# EAGLE board clouds_v30 (EAGLE 7.5.0)
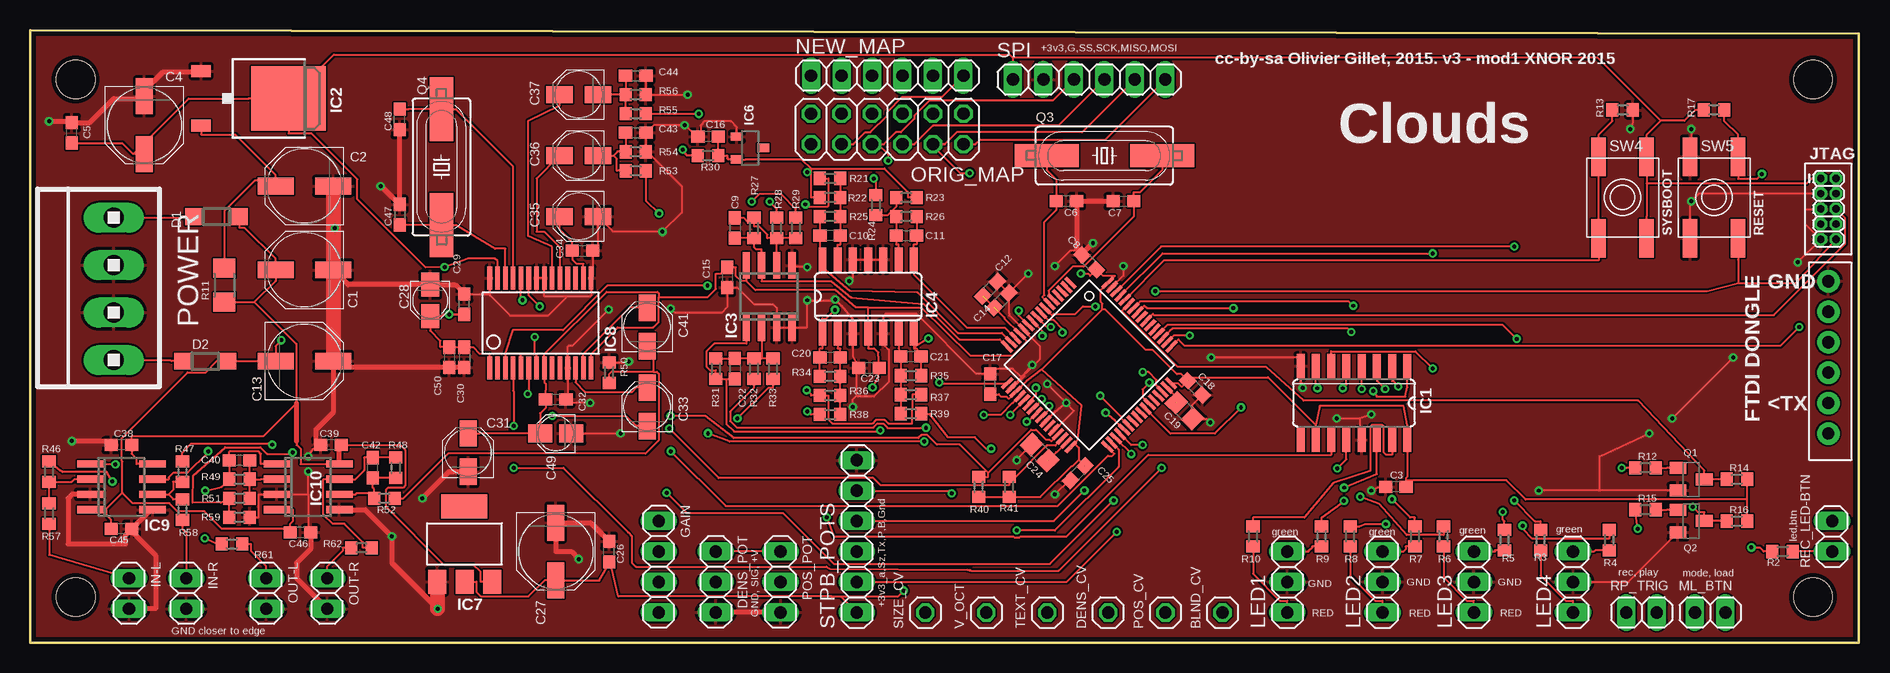
[diagram p4: board, top side]
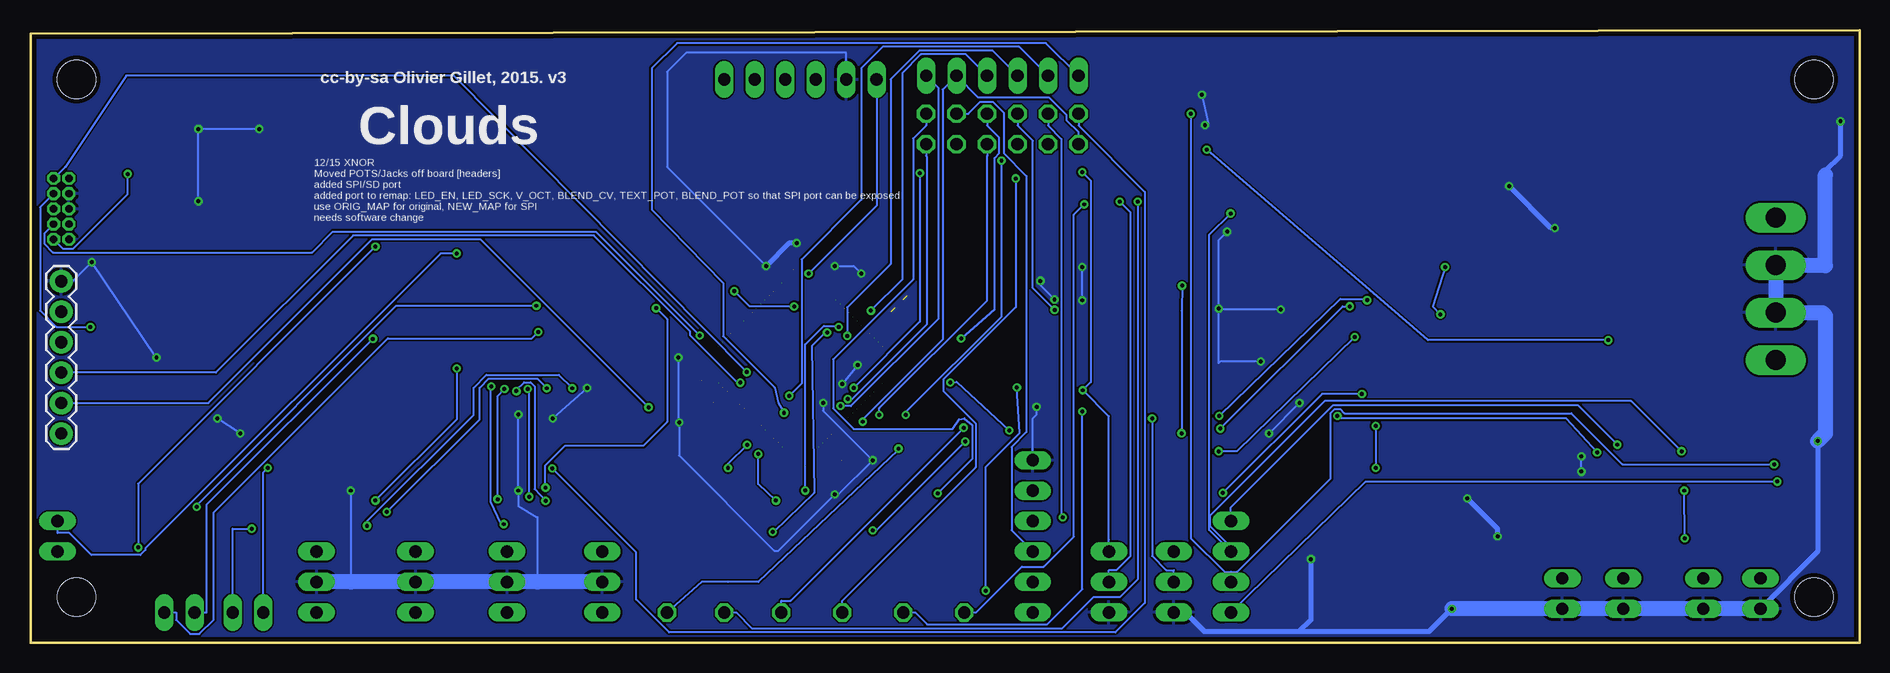
[diagram p5: board, bottom side, seen from below]

Size 152.4 x 51.12 mm. Coordinates in mm from the lower left corner, seen from the top.
Outline: 0,0 152.4,0 152.4,50.8 0,51.12 0,0
Copper layers (1*16): Top 0.0356mm / dielectric 1.5011mm / Bottom 0.0356mm
Design rules "LaenPCBOrder": minimum track width 6mil, minimum drill 13mil, track to track 6mil, track to pad 6mil, pad to pad 6mil, via to via 6mil, smd to smd 6mil, copper to edge 15mil, drill to drill 6mil, minimum pad ring 7mil, minimum via ring 7mil, stop-mask expansion 3mil, vias tented up to drill 0mil, thermal gap 10mil
Holes 3.2 mm at 3.81,46.99 3.81,3.81 148.59,46.99 148.59,3.81

## Footprints (pad centres in the part's own frame; a part is rotated, then mirrored left to right if it is on the bottom)
1X01 = drill 1.016 octagon: 1 0,0
PANASONIC_D = smd 3 x 1.4: + 2.4,0; - -2.4,0
C0603 = smd 1.1 x 1: 1 -0.85,0; 2 0.85,0
C0805 = smd 1.3 x 1.5: 1 -0.95,0; 2 0.95,0
PANASONIC_A = smd 2 x 1.5: + 1.3,0; - -1.3,0
PANASONIC_B = smd 2.2 x 1.4: + 1.6,0; - -1.6,0
SOD123 = smd 1.4 x 1.4: A 1.9,0; C -1.9,0
1X03 = drill 1.016 long: 1 -2.54,0; 2 0,0; 3 2.54,0
1X04 = drill 1.016 long: 1 -3.81,0; 2 -1.27,0; 3 1.27,0; 4 3.81,0
SO16 = smd 0.66 x 2.032: 1 -4.445,-3.073; 2 -3.175,-3.073; 3 -1.905,-3.073; 4 -0.635,-3.073; 5 0.635,-3.073; 6 1.905,-3.073; 7 3.175,-3.073; 8 4.445,-3.073; 9 4.445,3.073; 10 3.175,3.073; 11 1.905,3.073; 12 0.635,3.073; 13 -0.635,3.073; 14 -1.905,3.073; 15 -3.175,3.073; 16 -4.445,3.073
TO252 = smd 1 x 1.6: 1 -2.28,-4.8; 2 2.28,-4.8 | smd 5.4 x 6.2: 3 0,2.5
SO08 = smd 0.6 x 2.2: 1 -1.905,-2.6; 2 -0.635,-2.6; 3 0.635,-2.6; 4 1.905,-2.6; 5 1.905,2.6; 6 0.635,2.6; 7 -0.635,2.6; 8 -1.905,2.6
SO14 = smd 0.66 x 2.032: 1 -3.81,-3.073; 2 -2.54,-3.073; 3 -1.27,-3.073; 4 0,-3.073; 5 1.27,-3.073; 6 2.54,-3.073; 7 3.81,-3.073; 8 3.81,3.073; 9 2.54,3.073; 10 1.27,3.073; 11 0,3.073; 12 -1.27,3.073; 13 -2.54,3.073; 14 -3.81,3.073
TQFP-10X10-64 = smd 1.2 x 0.3: 1 -5.936,3.75; 2 -5.936,3.25; 3 -5.936,2.75; 4 -5.936,2.25; 5 -5.936,1.75; 6 -5.936,1.25; 7 -5.936,0.75; 8 -5.936,0.25; 9 -5.936,-0.25; 10 -5.936,-0.75; 11 -5.936,-1.25; 12 -5.936,-1.75; 13 -5.936,-2.25; 14 -5.936,-2.75; 15 -5.936,-3.25; 16 -5.936,-3.75; 33 5.886,-3.75; 34 5.886,-3.25; 35 5.886,-2.75; 36 5.886,-2.25; 37 5.886,-1.75; 38 5.886,-1.25; 39 5.886,-0.75; 40 5.886,-0.25; 41 5.886,0.25; 42 5.886,0.75; 43 5.886,1.25; 44 5.886,1.75; 45 5.886,2.25; 46 5.886,2.75; 47 5.886,3.25; 48 5.886,3.75 | smd 0.3 x 1.2: 17 -3.75,-5.911; 18 -3.25,-5.911; 19 -2.75,-5.911; 20 -2.25,-5.911; 21 -1.75,-5.911; 22 -1.25,-5.911; 23 -0.75,-5.911; 24 -0.25,-5.911; 25 0.25,-5.911; 26 0.75,-5.911; 27 1.25,-5.911; 28 1.75,-5.911; 29 2.25,-5.911; 30 2.75,-5.911; 31 3.25,-5.911; 32 3.75,-5.911; 49 3.75,5.936; 50 3.25,5.936; 51 2.75,5.936; 52 2.25,5.936; 53 1.75,5.936; 54 1.25,5.936; 55 0.75,5.936; 56 0.25,5.936; 57 -0.25,5.936; 58 -0.75,5.936; 59 -1.25,5.936; 60 -1.75,5.936; 61 -2.25,5.936; 62 -2.75,5.936; 63 -3.25,5.936; 64 -3.75,5.936
DBZ_R-PDSO-G3 = smd 0.7 x 1: 1 -0.95,-1.1; 2 0.95,-1.1; 3 0,1.1
SOT223 = smd 1.499 x 2.007: 1 -2.261,-3.15; 2 0.025,-3.15; 3 2.311,-3.15 | smd 3.81 x 2.007: 4 0,3.15
SSOP28 = smd 0.381 x 1.905: 1 -4.55,-3.752; 2 -3.9,-3.752; 3 -3.25,-3.752; 4 -2.6,-3.752; 5 -1.95,-3.752; 6 -1.3,-3.752; 7 -0.65,-3.752; 8 0,-3.752; 9 0.65,-3.752; 10 1.3,-3.752; 11 1.95,-3.752; 12 2.6,-3.752; 13 3.25,-3.752; 14 3.9,-3.752; 15 3.9,3.752; 16 3.25,3.752; 17 2.6,3.752; 18 1.95,3.752; 19 1.3,3.752; 20 0.65,3.752; 21 0,3.752; 22 -0.65,3.752; 23 -1.3,3.752; 24 -1.95,3.752; 25 -2.6,3.752; 26 -3.25,3.752; 27 -3.9,3.752; 28 -4.55,3.752
1X02 = drill 1.016 long: 1 -1.27,0; 2 1.27,0
1X06 = drill 1.016 pad 1.88: 1 0,0; 2 2.54,0; 3 5.08,0; 4 7.62,0; 5 10.16,0; 6 12.7,0
2X5-1.27 = drill 0.61 pad 1.067 octagon: 1 -1.27,3.81; 2 0,3.81; 3 -1.27,2.54; 4 0,2.54; 5 -1.27,1.27; 6 0,1.27; 7 -1.27,0; 8 0,0; 9 -1.27,-1.27; 10 0,-1.27
1X06' = drill 1.016 long: 1 -6.35,0; 2 -3.81,0; 3 -1.27,0; 4 1.27,0; 5 3.81,0; 6 6.35,0
2X06 = drill 1.016 octagon: 1 -6.35,-1.27; 2 -6.35,1.27; 3 -3.81,-1.27; 4 -3.81,1.27; 5 -1.27,-1.27; 6 -1.27,1.27; 7 1.27,-1.27; 8 1.27,1.27; 9 3.81,-1.27; 10 3.81,1.27; 11 6.35,-1.27; 12 6.35,1.27
1X4MTA = drill 1.676 long: 1 5.944,0; 2 1.981,0; 3 -1.981,0; 4 -5.944,0
SOT23-BEC = smd 1 x 1.4: B -0.95,-1.1; C 0,1.1; E 0.95,-1.1
HC49UP = smd 5.334 x 1.93: 1 -4.826,0; 2 4.826,0
R0603 = smd 1 x 1.1: 1 -0.85,0; 2 0.85,0
R1206 = smd 1.6 x 1.803: 1 -1.422,0; 2 1.422,0
EVQ-Q2 = smd 3.2 x 1.2: A -3.4,-2; A' 3.4,-2; B -3.4,2; B' 3.4,2

## Placement (x,y rotation side)
BLND_CV  [1X01]  99.38,2.54 90 top
C1  47u  [PANASONIC_D]  22.86,31.11 180 top
C2  47u  [PANASONIC_D]  22.86,38.1 180 top
C3  100n  [C0603]  113.82,13.02 180 top
C4  47u  [PANASONIC_D]  9.53,43.18 270 top
C5  100n  [C0603]  3.49,42.55 90 top
C6  18p  [C0603]  86.36,36.83 180 top
C7  18p  [C0603]  91.12,36.83 0 top
C8  100n  [C0603]  88.27,31.75 135 top
C9  1n  [C0603]  58.74,34.61 270 top
C10  1n  [C0603]  66.67,33.97 180 top
C11  1n  [C0603]  73.03,33.97 0 top
C12  1u  [C0603]  80.01,29.53 45 top
C13  47u  [PANASONIC_D]  22.86,23.5 0 top
C14  100n  [C0603]  80.96,28.57 45 top
C15  100n  [C0603]  58.1,30.48 270 top
C16  100n  [C0603]  56.52,42.23 180 top
C17  100n  [C0603]  80.01,21.59 90 top
C18  100n  [C0603]  97.09,21.27 315 top
C19  2.2u  [C0805]  96.2,19.37 315 top
C20  1n  [C0603]  66.67,23.81 180 top
C21  1n  [C0603]  73.41,23.88 0 top
C22  1n  [C0603]  58.74,22.86 270 top
C23  100n  [C0603]  69.91,22.92 180 top
C24  2.2u  [C0805]  84.14,15.88 135 top
C25  100n  [C0603]  87.31,14.16 225 top
C26  100n  [C0603]  48.26,7.62 90 top
C27  47u  [PANASONIC_D]  43.81,7.62 270 top
C28  10u  [PANASONIC_A]  33.34,28.57 270 top
C29  100n  [C0603]  36.2,28.26 90 top
C30  100n  [C0603]  36.2,23.81 270 top
C31  10u  [PANASONIC_B]  36.51,15.88 90 top
C32  100n  [C0603]  43.81,20.32 0 top
C33  10u  [PANASONIC_B]  51.44,19.68 90 top
C34  100n  [C0603]  46.04,32.7 0 top
C35  10u  [PANASONIC_B]  45.72,35.56 180 top
C36  10u  [PANASONIC_B]  45.72,40.64 180 top
C37  10u  [PANASONIC_B]  45.72,45.72 180 top
C38  100n  [C0603]  7.62,16.51 180 top
C39  100n  [C0603]  25.08,16.51 180 top
C40  18p  [C0603]  17.46,15.24 180 top
C41  10u  [PANASONIC_B]  51.44,26.35 90 top
C42  18p  [C0603]  28.57,14.61 90 top
C43  220p  [C0603]  50.48,42.55 0 top
C44  220p  [C0603]  50.48,47.31 0 top
C45  100n  [C0603]  7.62,9.53 180 top
C46  100n  [C0603]  22.54,9.21 180 top
C47  18p  [C0603]  30.8,35.72 270 top
C48  18p  [C0603]  30.8,43.66 90 top
C49  10u  [PANASONIC_A]  43.81,17.46 180 top
C50  1u  [C0603]  34.92,23.81 270 top
D1  1N5819HW  [SOD123]  15.56,35.56 180 top
D2  1N5819HW  [SOD123]  14.61,23.5 0 top
DENS_CV  [1X01]  89.85,2.54 90 top
DENS_POT  [1X03]  57.15,5.08 270 top
GAIN  [1X04]  52.39,6.35 270 top
IC1  74HC595D  [SO16]  110.33,20 180 top
IC2  LM1117-3.3  [TO252]  19.05,45.4 270 top
IC3  MCP6002  [SO08]  61.59,28.89 0 top
IC4  MCP6004  [SO14]  69.85,28.89 0 top
IC5  STM32F405RGT6  [TQFP-10X10-64]  88.27,23.18 315 top
IC6  LM4040B10  [DBZ_R-PDSO-G3]  60.01,41.27 270 top
IC7  LM1117-3.3  [SOT223]  36.2,8.26 0 top
IC8  WM8731  [SSOP28]  42.86,26.67 0 top
IC9  TL072D  [SO08]  7.62,13.02 270 top
IC10  TL072D  [SO08]  23.18,13.02 270 top
IN-L  [1X02]  8.26,4.13 270 top
IN-R  [1X02]  13.02,4.13 270 top
JP1  [1X06]  149.86,30.16 270 bottom
JP2  M05X2MINIJTAG  [2X5-1.27]  150.5,34.92 0 top
LED1  [1X03]  104.78,5.08 90 top
LED2  [1X03]  112.71,5.08 90 top
LED3  [1X03]  120.33,5.08 90 top
LED4  [1X03]  128.59,5.08 90 top
ML_BTN  [1X02]  140.02,2.54 0 top
NEW_MAP  [1X06']  71.44,47.31 0 top
ORIG_MAP  [2X06]  71.44,42.86 0 top
OUT-L  [1X02]  19.68,4.13 270 top
OUT-R  [1X02]  24.77,4.13 270 top
POS_CV  [1X01]  94.61,2.54 90 top
POS_POT  [1X03]  62.55,5.08 270 top
POWER  [1X4MTA]  6.99,29.53 90 top
Q1  MMBT3904  [SOT23-BEC]  138.43,13.65 270 top
Q2  MMBT3904  [SOT23-BEC]  138.43,10.16 270 top
Q3  8MHz  [HC49UP]  89.53,40.64 0 top
Q4  12.288MHz  [HC49UP]  34.29,39.69 90 top
R2  RLED  [R0603]  146.05,7.62 0 top
R3  RLED  [R0603]  125.89,8.57 90 top
R4  RLED  [R0603]  131.6,8.57 90 top
R5  RLED  [R0603]  122.87,8.57 90 top
R6  RLED  [R0603]  117.79,8.89 90 top
R7  RLED  [R0603]  115.41,8.89 90 top
R8  RLED  [R0603]  110.01,8.89 90 top
R9  RLED  [R0603]  107.63,8.89 90 top
R10  RLED  [R0603]  101.92,8.89 90 top
R11  4.7  [R1206]  16.19,29.84 90 top
R12  100k  [R0603]  134.62,14.61 0 top
R13  10k  [R0603]  132.72,44.45 180 top
R14  10k  [R0603]  142.24,13.65 0 top
R15  100k  [R0603]  134.62,11.11 0 top
R16  10k  [R0603]  142.24,10.16 0 top
R17  10k  [R0603]  140.34,44.45 180 top
R21  100k  [R0603]  66.67,38.73 180 top
R22  200k  [R0603]  66.67,37.15 180 top
R23  200k  [R0603]  73.03,37.15 0 top
R24  100k  [R0603]  70.48,36.51 90 top
R25  33k  [R0603]  66.67,35.56 0 top
R26  33k  [R0603]  73.03,35.56 180 top
R27  66.5k  [R0603]  60.33,34.61 90 top
R28  200k  [R0603]  62.23,34.61 90 top
R29  100k  [R0603]  63.82,34.61 90 top
R30  470  [R0603]  56.52,40.64 0 top
R31  66.5k  [R0603]  57.15,22.86 90 top
R32  100k  [R0603]  60.33,22.86 270 top
R33  200k  [R0603]  61.91,22.86 270 top
R34  47k  [R0603]  66.67,22.23 0 top
R35  33k  [R0603]  73.41,22.29 180 top
R36  180k  [R0603]  66.67,20.64 180 top
R37  200k  [R0603]  73.41,20.7 0 top
R38  100k  [R0603]  66.67,19.05 180 top
R39  100k  [R0603]  73.41,19.11 0 top
R40  2.2k  [R0603]  79.06,13.02 270 top
R41  2.2k  [R0603]  81.6,13.02 270 top
R46  3.3k  [R0603]  1.59,14.29 270 top
R47  3.3k  [R0603]  12.7,14.29 270 top
R48  39k  [R0603]  30.48,14.61 270 top
R49  39k  [R0603]  17.46,13.65 0 top
R50  39k  [R0603]  48.26,22.54 270 top
R51  5.6k  [R0603]  17.46,12.06 180 top
R52  5.6k  [R0603]  29.53,12.06 0 top
R53  5.6k  [R0603]  50.48,39.37 0 top
R54  5.6k  [R0603]  50.48,40.96 180 top
R55  5.6k  [R0603]  50.48,44.13 0 top
R56  5.6k  [R0603]  50.48,45.72 180 top
R57  22k  [R0603]  1.59,10.79 270 top
R58  22k  [R0603]  12.7,11.11 270 top
R59  39k  [R0603]  17.46,10.48 180 top
R61  1.0k  [R0603]  16.83,8.26 180 top
R62  1.0k  [R0603]  27.62,7.94 0 top
REC_LED-BTN  [1X02]  150.18,8.89 90 top
RP_TRIG  [1X02]  134.3,2.54 0 top
SIZE_CV  [1X01]  74.61,2.54 90 top
SPI  [1X06']  88.27,46.99 0 top
STPB_POTS  [1X06']  68.9,8.89 90 top
SW4  [EVQ-Q2]  132.72,37.15 270 top
SW5  [EVQ-Q2]  140.34,37.15 270 top
TEXT_CV  [1X01]  84.77,2.54 90 top
V_OCT  [1X01]  79.69,2.54 90 top

## Tracks (layer width: path | path; a pad name or v marks a point on that pad's centre or on a via)
+3V3  (via drill 0.33 pad 0.3, 0.33 pad 0.69)  (7 unrouted)
  Top 0.152: 95.94,22.42 | 95.94,22.42 95.57,22.42 93.55,24.45 92.98,24.45 89.6,27.82 89.36,27.82 | 84.33,22.8 89.36,27.82 | 84.33,22.8 87.64,19.81 87.32,16.93 87.03,16.64 | 84.33,22.8 83.05,21.85 82.73,21.53 IC5.19 81.85,20.65 81.56,20.36 81.38,20.53 80.95,20.53 80.74,20.74 C17.1 | 87.03,16.64 87.4,16.27 87.4,15.28 | 87.4,15.28 | IC5.32 87.03,16.64 | C25.1 87.4,15.28 | 87.4,15.28 86.88,14.76 86.8,14.76 84.2,12.17 R41.2 R40.2 | 96.22,22.15 103.18,22.15 107.16,18.17 | 143.09,11.96 R14.2 | R16.2 143.09,11.96 | 143.09,11.96 124.63,11.96 123.03,13.56 114.67,13.56 | 114.67,13.56 114.67,13.75 114.78,13.85 IC1.16 114.78,18.17 114.47,19.75 107.46,19.75 107.16,18.17 | C3.1 114.67,13.56 | 96.22,22.15 95.94,22.42 | 96.22,22.15 C18.1 96.3,21.68 95.97,21.36 95.67,21.67 IC5.48 | 135.89,43.55 130.66,48.79 81.92,48.79 | 135.89,43.55 137.86,43.55 138.76,44.45 139.12,44.45 R17.2 | 135.89,43.55 | 135.89,43.55 134.72,42.38 134.72,41.46 SW4.B 134.72,38.34 | 81.92,48.79 SPI.1 | 21.55,45.28 25.33,49.07 81.64,49.07 81.92,48.79 | 21.55,45.28 IC2.3 18.22,45.4 13.22,45.4 8.6,40.78 | 21.55,45.28 21.55,45.27 21.55,42.47 23.48,42.47 27.29,38.66 27.29,37 32.97,31.32 34.57,31.35 34.58,31.34 | 89.36,27.82 89.36,28.3 89.22,28.43 89.22,29.44 | 89.22,29.44 | v87.58,30.8 88.19,30.8 88.35,30.63 C8.1 89.42,30.6 89.43,30.61 90.4,30.61 | 134.72,38.34 134.72,35.58 SW4.B' | 134.72,38.34 148.07,38.34 148.46,38.73 JP2.1 | C5.1 7.68,41.7 8.6,40.78 | C4.+ 8.6,40.78 | 89.22,29.44 IC5.64 90.1,30.32 90.4,30.61 | C29.1 v34.92,27.41 | v34.92,27.41 34.45,27.41 34.32,27.27 C28.+ 33.34,26.05 34.2,25.19 34.2,24.66 C50.1 C30.1 36.92,24.66 37.49,24.1 38.31,24.1 IC8.1
  Top 0.152: 36.56,27.41 C29.1 | IC1.10 107.16,18.17 | 90.4,30.61 | IC8.27 38.96,31.84 38.73,32.07 36.51,32.07 34.58,31.34 | 34.58,31.34 v34.54,31.34 | v34.92,27.41 C29.1
  Bottom 0.152: SPI.1 81.92,36.46 v87.58,30.8 | v34.54,31.34 35.56,28.04 v34.92,27.41
+3V3_A  (via drill 0.33 pad 0.69)  (3 unrouted)
  Top 0.152: 52.39,28.81 52.39,29.16 52.27,29.28 48.05,29.28 42.86,24.1 IC8.8 42.86,21.74 42.97,21.63 42.97,21.05 C32.1 42.97,19.59 42.52,19.14 42.52,18.44 C49.+ 37.45,17.46 37.44,17.48 C31.+ | 52.39,28.81 52.39,26.78 51.92,26.31 48.97,26.31 46.76,24.1 46.76,23.43 IC8.14 | 52.39,28.81 56.44,28.81 56.44,28.82 57.15,29.53 57.15,30.8 57.57,30.8 C15.1 58.83,31.33 58.83,30.6 59.27,30.16 59.69,30.16 | 69.85,27.95 68.83,27.98 67.09,29.44 60.44,29.41 59.69,30.16 | 66.81,3.88 49.02,3.88 48.35,6.77 | 66.81,3.88 72.34,3.88 v72.81,4.36 | v70.22,21.31 70.7,22.18 C23.1 70.7,24.22 70.35,24.57 69.85,24.57 69.85,25.2 IC4.4 69.85,26.99 69.85,27.95 | 69.85,27.95 74.27,27.95 78.35,23.96 81.88,23.96 83.06,25.15 83.06,25.2 IC5.13 81.19,27.07 81.19,27.14 | 81.19,27.14 | 79.73,28.61 80.68,27.66 80.94,27.4 81.19,27.14 | IC3.8 59.69,30.24 59.69,30.16 | 59.69,30.16 | 48.35,6.77 48.62,6.77 48.35,6.77 | 48.35,6.77 C26.1 | 48.35,6.77 47.44,5.22 C27.+ 43.35,5.22 42.89,5.22 41.54,3.87 37.58,3.87 37.2,4.25 37.2,5.11 IC7.2 | 66.81,3.88 67.56,3.88 STPB_POTS.1
  Bottom 0.152: v72.81,4.36 72.81,14.69 69.99,17.51 v70.22,21.31
AREF_-10  (via drill 0.33 pad 0.69)
  Top 0.152: R37.2 73.53,20.7 73.5,18.28 72.78,18.27 71.54,18.27 71.22,18.59 70.5,18.59 70.17,18.27 66.88,18.27 66.55,18.6 66.55,20.64 R36.2 65.1,20.64 65.1,20.71 v64.73,21.08 | 65.1,39.27 65.1,39.56 | 65.1,39.27 65.1,37.15 R22.2 | v64.77,39.27 65.1,39.27 | 65.1,39.56 64.33,40.33 59.64,40.33 IC6.2 58.18,40.33 58.09,40.41 58.09,40.64 57.73,40.64 | 65.1,39.56 71.19,39.56 73.15,37.6 73.15,37.15 R23.2 | 57.73,40.64 57.37,41 C16.1 | R30.2 57.73,40.64 | POS_POT.1 DENS_POT.1
  Bottom 0.152: v64.77,39.27 64.05,38.55 64.05,21.76 v64.73,21.08 62.55,18.89 62.55,8.61 POS_POT.1
BLEND_CV  (via drill 0.33 pad 0.69)
  Top 0.152: 73.66,24.63 73.66,24.57 73.84,24.57 73.88,24.54 C21.2 R35.1 | IC4.7 73.66,24.63 | v74.87,25.39 73.66,24.63
  Bottom 0.152: v74.87,25.39 72.08,27.84 72.08,40.45 71.7,40.83 71.7,42.13 72.71,43.14 ORIG_MAP.8
BLEND_POT  (via drill 0.33 pad 0.69)
  Top 0.152: STPB_POTS.5 76.6,12.7 v76.82,12.48
  Bottom 0.152: v76.82,12.48 73.96,15.34 73.96,18.18 74.59,18.74 75.03,18.65 75.58,17.84 83.82,17.84 85.53,19.56 85.53,23.64 78.87,30.3 78.87,42.06 77.79,43.14 ORIG_MAP.12
BOOT_FLASH  (1 unrouted)
  Top 0.152: IC5.60 94.53,31.91 130.71,31.91 130.72,31.92 SW4.A' SW4.A 130.72,42.38 131.87,43.53 R13.2
DENSITY_CV  (via drill 0.33 pad 0.69)  (1 unrouted)
  Top 0.152: 58.03,22.01 58.03,18.27 58.68,17.63 70.77,17.63 v70.86,17.72 | 58.03,22.01 C22.2 | 58.03,22.01 R31.1 57.15,22.74 56.7,22.74 56.37,23.06 56.37,24.31 57.02,24.96 59.69,24.96 IC3.1 | v75.78,21.72 75.85,21.65 IC5.17
  Bottom 0.152: v75.78,21.72 75.24,21.78 v70.86,17.72
GND  (via drill 0.33, 0.33 pad 0.3, 0.33 pad 0.69)
  Top 0.152: v98.42,23.81 105.73,23.81 IC1.8 105.89,21.75 v106.05,21.27 | LED4.2 133.2,5.08 Q2.E | R13.1 133.56,43.4 v133.35,42.86 | v138.43,42.86 138.43,40.64 SW5.A | SW5.A' 138.34,36.73 v138.43,36.83 139.06,37.47 JP2.3 JP2.5 147.96,36.2 147.96,34.92 JP2.9 v147.32,31.75 | v125.73,12.7 Q1.E 130.81,12.7 130.81,15.56 v134.94,17.46 | v136.84,18.73 v141.92,23.81 | C3.2 112.97,13.28 v111.76,12.7 | v108.9,18.73 110.81,18.73 | 110.81,18.73 110.81,17.09 IC1.13 | v111.76,19.05 110.81,18.73 | v91.12,31.43 91.12,30.63 IC5.63 | C12.2 C14.2 | C14.2 81.56,27.59 81.6,27.3 81.66,27.3 IC5.12 82.83,26.07 84.14,24.77 84.14,23.65 IC5.18 81.94,21.3 | 81.94,21.3 82.87,22.23 82.55,22.23 81.92,22.86 80.43,22.86 C17.2 78.87,22.44 73.88,27.43 71.31,27.43 71.09,27.21 71.09,25.85 IC4.5 71.12,24.89 71.56,24.45 71.56,21.78 70.33,20.54 68.99,20.54 68.9,20.64 | 87.21,32.8 87.1,32.8 87,32.7 86.68,32.7 v85.41,31.43 | v83.19,30.8 C14.2 | IC6.1 58.91,43.01 58.42,43.5 56.2,43.5 55.88,43.18 55.88,42.44 C16.2 55.56,42.23 54.61,43.18 v54.55,43.18 | v54.55,43.18 54.07,43.18 | 54.07,43.18 51.97,43.18 C43.2 R54.1 51.44,40.96 54.29,38.1 54.29,35.88 v52.7,34.29 48.59,34.29 C35.- 47.32,33.13 C34.2 46.89,30.55 IC8.15 46.76,28.98 46.67,28.89 44.77,28.89 | C44.2 R56.1 v54.8,45.72 | IC4.10 IC4.11 IC4.12 68.58,30.51 v68.26,30.19 | R59.1 19.05,10.48 19.05,12.38 IC10.3 23.18,12.38 | 23.18,12.38 23.18,9.42 C46.1 | 23.18,12.38 v23.18,14.29 | v23.18,15.56 23.6,16.19 C39.2 | v86.36,20 85.2,19.05 IC5.26 | IC5.28 85.39,17.76 87,19.37 v86.36,20 | C25.2 86.58,13.56 v85.41,12.38 | v82.23,15.24 82.23,15.31 C24.2 | 81.94,21.3 v83.5,23.18 | v84.77,21.59 v86.36,20
  Top 0.152: IC8.22 IC8.21 42.86,28.89 44.77,28.89 | C49.- v49.21,17.46 | v46.67,20 44.98,20 C32.2 44.81,20.47 IC8.11 44.81,24.71 44.9,24.8 45.21,24.8 v48.23,27.81 | v68.58,19.68 68.58,20.32 68.9,20.64 | 68.9,20.64 68.9,23.39 C23.2 68.58,23.91 IC4.3 68.58,26.99 67.6,28.13 v67.09,28.64 | v53.4,27.88 53.75,27.53 57.63,27.53 58.1,28 C15.2 58.95,29.63 60.33,28.26 61.91,28.26 62.23,27.94 IC3.3 IC3.4 64.71,26.29 64.77,26.35 v64.77,28.57 66.9,28.57 | R50.1 49.84,23.39 v49.91,23.46 | IC8.28 38.31,29 | 38.31,29 40.01,27.3 43.18,27.3 44.77,28.89 | C29.2 38.2,29.11 38.31,29 | 66.9,28.57 v67.09,28.64 | v98.36,18.38 98.05,18.7 C19.2 96.87,19.85 C18.2 | v64.77,31.34 63.66,31.34 IC3.5 | v67.09,28.64 66.9,28.57 | v54.55,43.18 54.07,43.18
  Top 0.406: C2.- 25.26,34.75 v25.4,34.61 | v29.21,38.1 29.27,38.1 C47.1 C48.1 | C1.- 26.5,29.88 C28.- 35.43,29.88 C29.2 | v1.59,43.5 3.39,43.5 C5.2 4.98,43.4 6.99,45.4 9.35,45.4 C4.- 9.53,46.04 11.11,47.62 14.19,47.62 IC2.1 | v3.49,16.83 6.45,16.83 C38.2 | IC9.5 10.06,11.11 C45.1 | IC9.3 3.49,12.38 3.17,12.06 3.17,8.26 7.94,8.26 7.94,8.99 C45.1 | C45.1 8.47,9.31 10.48,7.3 10.48,2.86 IN-L.2 | C46.1 23.39,7.83 22.23,6.67 22.23,5.4 OUT-R.2 | IC10.5 27.94,11.11 v30.16,8.89 30.16,6.67 v33.97,2.86 | C26.2 46.71,10.02 C27.- 43.81,7.62 45.09,7.62 v45.72,6.99 | POS_POT.3 DENS_POT.3 | C7.1 C6.1 87.21,32.8 C8.2 87.66,32.42 v88.58,33.34 | C39.2 23.81,16.61 23.81,17.78 25.26,19.23 C13.+ 25.79,22.96 C30.2 C50.2 | v32.7,12.06 34.92,14.29 C31.-
  Top 1.27: C2.- C1.- C13.+ | v33.97,2.86 33.97,5.07 IC7.1
  Bottom 0.152: v133.35,42.86 v138.43,42.86 v138.43,36.83 | JP1.1 148.91,30.16 v147.32,31.75 v141.92,23.81 | v125.73,12.7 125.73,5.08 | v134.94,17.46 v136.84,18.73 | 110.17,5.08 110.17,10.48 111.76,11.43 v111.76,12.7 v111.76,19.05 | v106.05,21.27 v108.9,18.73 | SPI.2 84.45,49.21 97.79,49.21 99.38,47.62 99.38,39.69 v91.12,31.43 | v85.41,31.43 83.82,31.43 v83.19,30.8 | v23.18,14.29 v23.18,15.56 | v83.5,23.18 v84.77,21.59 | v49.21,17.46 v46.67,20 | v86.36,20 86.36,19.37 v82.23,15.24 85.09,12.38 v85.41,12.38 90.11,7.68 90.42,7.68 98.36,15.62 v98.36,18.38 98.42,18.45 v98.42,23.81 | STPB_POTS.6 68.9,18.73 68.58,19.05 v68.58,19.68 | v53.4,27.88 53.4,33.59 v52.7,34.29 | v49.91,23.46 53.28,23.46 53.4,23.34 v53.4,27.88 | v48.23,27.81 53.34,27.81 v53.4,27.88 | v64.77,28.57 v64.77,31.34 | v68.26,30.19 68.26,29.84 v67.09,28.64 | v54.8,45.72 54.26,43.31 v54.55,43.18
  Bottom 0.406: v25.4,34.61 25.72,34.61 v29.21,38.1 | 2.86,39.05 2.86,39.37 1.59,40.64 v1.59,43.5 | DENS_POT.3 56.2,2.54 54.61,0.95 46.67,0.95 | 46.67,0.95 35.88,0.95 v33.97,2.86 | v45.72,6.99 45.72,1.91 46.67,0.95 | v88.58,33.34 89.22,33.34 v91.12,31.43 | v30.16,8.89 30.16,9.53 v32.7,12.06 | v3.49,16.83 3.49,7.62 IN-L.2
  Bottom 1.27: LED1.2 110.17,5.08 LED2.2 LED3.2 125.73,5.08 LED4.2 | 2.86,39.05 2.86,31.43 2.93,31.51 POWER.2 POWER.3 3.1,27.55 2.86,27.3 2.86,17.46 v3.49,16.83 | IN-L.2 IN-R.2 OUT-L.2 OUT-R.2 v33.97,2.86
  pour Bottom: 0,51.44 0,0 152.08,0.32 152.4,50.8
  pour Top: 0,51.12 152.4,50.8 153.03,0.32 0,0
I2C_SCL  (via drill 0.33 pad 0.69)  (1 unrouted)
  Top 0.152: 79.84,14.19 77.47,16.55 75.58,16.55 74.77,17.36 74.3,17.36 74.03,17.09 58.62,17.09 56.28,18.93 v53.37,18.93 | 79.84,14.19 83.42,17.77 83.84,17.77 84.66,16.96 84.95,16.96 85.09,16.82 IC5.29 | 79.84,14.19 79.84,13.87 R40.1 | v41.04,28.58 40.91,28.71 IC8.24
  Bottom 0.152: v53.37,18.93 43.27,28.68 41.14,28.68 v41.04,28.58
I2C_SDA  (via drill 0.33 pad 0.69)  (1 unrouted)
  Top 0.152: v53.27,17.87 57.39,13.75 70.28,13.75 70.9,13.14 81.6,13.14 R41.1 81.79,13.87 81.99,13.87 82.13,13.87 84.73,16.47 85.44,16.47 | v42.49,28.07 41.56,28.99 IC8.23 | 85.44,16.47 | IC5.30 85.44,16.47
  Bottom 0.152: v53.27,17.87 43.08,28.07 v42.49,28.07
I2S_LRCK  (via drill 0.33 pad 0.69)  (1 unrouted)
  Top 0.152: 42.06,24.1 42.21,24.1 IC8.7 | 42.06,24.1 40.91,24.1 IC8.5 | 42.06,24.1 v42.06,25.5 | IC5.33 90.36,15.78 90.19,15.61 89.82,15.61 85.63,11.42 57.98,11.42 v53.41,15.98
  Bottom 0.152: v42.06,25.5 51.9,15.98 v53.41,15.98
I2S_SCK  (via drill 0.33 pad 0.69)  (1 unrouted)
  Top 0.152: v56.46,29.79 48.12,29.79 44.43,26.1 40.25,26.1 39.61,24.19 IC8.3 | v74.53,16.79 58.31,16.79 v56.5,17.49 | IC5.34 90.72,16.12 90.72,14.7 85.4,9.38 v82.24,9.38
  Bottom 0.152: v82.24,9.38 81.94,9.38 v74.53,16.79 | v56.46,29.79 56.5,27.71 v56.5,17.49
I2S_SIN  (via drill 0.33 pad 0.69)  (1 unrouted)
  Top 0.152: v91.78,15.75 91.81,15.75 IC5.35 | v53.05,12.52 54.72,10.85 62.73,10.85 66.99,6.59 84.98,6.59 90.27,11.87 v90.3,11.87 | IC8.6 41.56,20.87 v41.47,20.77
  Bottom 0.152: v90.3,11.87 91.78,13.25 v91.78,15.75 | v41.47,20.77 44.79,20.77 v53.05,12.52
I2S_SOUT  (via drill 0.33 pad 0.3)
  Top 0.152: IC8.4 40.26,21.02 40.32,20.95 v40.32,18.1 | v40.32,14.61 44.45,14.61 49.85,9.21 50.16,8.89 50.16,6.67 50.48,6.35 66.36,6.35 66.64,6.19 78.11,6.1 | 78.11,6.1 78.42,6.03 | 78.42,6.03 78.11,6.1 | 78.11,6.1 78.36,6.1 78.42,6.03 | 78.42,6.03 85.72,6.03 v94.3,14.61 | v92.71,16.51 91.75,16.51 IC5.36
  Bottom 0.152: v40.32,18.1 v40.32,14.61 | v94.3,14.61 94.3,14.92 v92.71,16.51
JTCK  (via drill 0.33 pad 0.69)  (1 unrouted)
  Top 0.152: IC5.49 95.7,25.31 96.23,24.78 145.86,24.78 v147.43,26.35
  Bottom 0.152: JP2.4 151.61,36.35 151.61,27.71 150.26,26.35 v147.43,26.35
JTDI  (via drill 0.33 pad 0.69)  (1 unrouted)
  Top 0.152: IC5.50 95.35,25.66 95.36,25.64 v96.64,25.64
  Bottom 0.152: JP2.8 151.26,34.16 151.26,33.28 150.56,32.58 128.96,32.58 127.23,34.3 105.3,34.3 v96.64,25.64
JTDO  (1 unrouted)
  Top 0.152: IC5.55 93.58,27.43 93.66,27.35 145.33,27.35 151.26,33.28 151.26,35.42 JP2.6
JTMS  (via drill 0.33 pad 0.69)  (1 unrouted)
  Top 0.152: IC5.46 93.86,21.48 93.86,21.95 93.22,22.58 v92.73,22.58
  Bottom 0.152: v92.73,22.58 117.14,47.31 144.46,47.31 149.54,39.69 JP2.2
LED_DATA  (via drill 0.33 pad 0.69)  (1 unrouted)
  Top 0.152: IC5.57 92.87,28.14 93.09,27.92 v100.29,27.92 | v109.51,12.95 112.24,14.1 IC1.14
  Bottom 0.152: v100.29,27.92 99.37,27 99.37,18.43 101.37,16.43 107.89,16.43 109.56,14.76 109.56,13.01 v109.51,12.95
LED_EN  (via drill 0.33 pad 0.69)
  Top 0.152: v108.95,14.56 109.7,15.31 IC1.12
  Bottom 0.152: ORIG_MAP.2 65.09,43.14 59.55,37.6 59.55,3.35 62.01,0.89 99.2,0.89 101.95,3.64 101.95,7.56 v108.95,14.56
LED_REC  (via drill 0.33 pad 0.69)  (1 unrouted)
  Top 0.152: v123.68,33.05 v123.67,33.06 94.26,33.06 IC5.62 | R2.1 144.47,7.62 144.13,7.96 v143.45,7.96
  Bottom 0.152: v123.68,33.05 143.45,13.28 v143.45,7.96
LED_SCK  (via drill 0.33 pad 0.69)
  Top 0.152: v66.4,10.47 66.98,8.88 66.99,8.89 81.93,8.88 82,8.81 82.47,8.81 82.55,8.88 86.39,8.88 93.19,15.68 108.43,15.68 IC1.11
  Bottom 0.152: v66.4,10.47 66.51,10.35 66.51,42.03 67.63,43.14 ORIG_MAP.4
LIN
  Top 0.152: C37.+ 44.12,44.79 41.53,43.53 41.53,33.95 43.51,33.05 IC8.20
LOUT
  Top 0.152: C33.+ 50.51,21.29 50.17,20.95 46.25,20.95 45.46,21.74 IC8.12
LOUT_JACK
  Top 0.152: OUT-L.1 19.68,6.39 18.41,7.67 18.41,8.26 R61.1
N$1  (via drill 0.33 pad 0.69)
  Top 0.152: R21.2 66.55,38.73 66.55,36.46 66.47,36.37 64.83,36.37 v64.62,36.58
  Bottom 0.152: SIZE_CV.1 73.62,2.54 69.81,6.35 67.99,6.35 65.48,8.86 65.48,35.71 v64.62,36.58
N$2
  Top 0.152: IC4.13 67.31,33.21 67.49,33.21 67.53,33.24 C10.1 R25.2 R22.1 R21.1
N$4  (via drill 0.33 pad 0.69)
  Top 0.152: v70.31,38.73 70.48,38.56 R24.2
  Bottom 0.152: v70.31,38.73 70.31,28 76.35,21.95 76.35,21.02 73.66,18.32 73.66,14.65 84.77,3.53 TEXT_CV.1
N$5
  Top 0.152: IC4.9 72.39,33.21 72.21,33.21 72.17,33.24 C11.1 R26.2 71.77,35.96 | 71.77,35.96 72.17,36.37 R23.1 | 71.77,35.96 71.47,35.66 71.19,35.66 R24.1
N$6  (via drill 0.33 pad 0.69)
  Top 0.152: v80.09,16.2 79.68,16.2 78.74,17.14 76.5,17.15 74.98,19.11 R39.2
  Bottom 0.152: v80.09,16.2 80.09,16.09 91.76,5.08 94.3,5.08 96.5,5.08 BLND_CV.1
N$7  (1 unrouted)
  Top 0.152: IC5.5 84.89,29.03 84.89,29.38 86.88,31.37 87.8,31.37 91.97,35.55 C7.2 91.97,37.56 92.47,37.56 94.36,39.45 Q3.2
N$8  (1 unrouted)
  Top 0.152: IC5.6 84.36,28.84 84.52,29 84.52,35.12 85.51,36.1 C6.2 85.51,38.65 84.71,39.45 Q3.1
N$9
  Top 0.152: R9.1 106.85,8.04 106.85,7.95 106.53,7.62 LED1.3
N$10  (via drill 0.33 pad 0.69)
  Top 0.152: R38.2 65.1,19.05 64.84,19.3 v64.77,19.3
  Bottom 0.152: V_OCT.1 78.7,2.54 77.71,1.55 67.7,1.55 64.77,4.48 v64.77,19.3
N$11
  Top 0.152: R38.1 R36.1 R34.2 C20.1 67.53,24.54 67.49,24.57 67.31,24.57 IC4.2
N$12
  Top 0.152: LED1.1 104.78,3.53 104.16,3.53 101.92,5.77 R10.1
N$13  (2 unrouted)
  Top 0.152: IC5.47 95.53,20.51 C19.1
N$14  (via drill 0.33 pad 0.69)
  Top 0.152: v74.67,17.95 74.52,17.92 71.46,17.92 71.09,18.29 70.62,18.29 70.29,17.95 58.9,17.95 58.35,18.5 58.35,19.3 60.33,21.28 R32.2
  Bottom 0.152: v74.67,17.95 89.08,3.53 89.85,3.53 DENS_CV.1
N$15
  Top 0.152: IC4.6 72.39,24.57 72.4,24.57 72.4,24.54 72.56,24.24 C21.1 R35.2 72.56,21.51 R37.1 R39.1
N$16
  Top 0.152: LED2.1 112.71,3.53 112.09,3.53 110.01,5.61 R8.1
N$17
  Top 0.152: IC8.16 46.11,31.6 45.56,31.6 45.19,31.97 C34.1 45.19,33.43 44.12,34.5 C35.+
N$18
  Top 0.152: C44.1 R56.2 | R55.1 R56.2 | R56.2 C37.-
N$19  (2 unrouted)
  Top 0.152: C24.1 85.5,15.89 | IC5.31 85.58,15.89 85.5,15.89 | 85.5,15.89
N$20
  Top 0.152: R58.2 12.7,9.53 13.02,9.22 IN-R.1
N$21
  Top 0.152: IN-L.1 1.59,7.34 1.62,8.9 1.59,9.53 R57.2
N$22
  Top 0.152: C43.1 R54.2 48.9,40.96 48.9,40.9 48.65,40.64 | R53.1 48.9,39.37 48.9,40.38 48.65,40.64 | C36.- 48.65,40.64
N$23
  Top 0.152: 51.94,22.61 52.25,22.61 52.41,22.45 52.41,16.91 51.3,15.79 34.84,15.79 31.11,12.06 R52.2 | 51.94,22.61 48.45,22.61 48.26,22.42 48.26,21.79 48.26,21.74 R50.2 | 51.94,22.61 51.94,24.75 C41.-
N$24
  Top 0.152: 60.96,23.71 R32.1 C22.1 R31.2 | R33.1 60.96,23.71 | IC3.2 60.96,23.71
N$25
  Top 0.152: IC10.6 27.11,12.38 27.18,12.45 28.68,12.45 | 28.68,12.45 28.68,12.84 28.57,12.95 C42.1 R48.2 | R52.1 28.68,12.45
N$26  (via drill 0.33 pad 0.69)
  Top 0.152: R33.2 61.91,21.28 61.52,21.28 v58.96,18.72
  Bottom 0.152: DENS_POT.2 57.15,6.07 57.77,6.07 58.96,7.26 v58.96,18.72
N$27  (via drill 0.33 pad 0.69)
  Top 0.152: R29.2 63.82,36.19 62.59,37.42 60.75,37.42 v60.14,36.81
  Bottom 0.152: POS_CV.1 93.62,2.54 92.28,1.19 66.47,1.19 63.86,3.81 61.65,3.81 60.14,5.32 v60.14,36.81
N$28
  Top 0.152: R62.2 27.74,7.94 27.74,8.39 26.2,9.94 25.21,9.94 24.45,10.7 24.45,13.65 IC10.7 27.11,13.65 27.85,14.39 27.85,15.46 C42.2 R48.1
N$29
  Top 0.152: R7.1 114.63,8.04 114.63,7.79 114.47,7.62 LED2.3
N$30
  Top 0.152: IC3.6 R28.1 | C9.1 59.47,35.46 59.83,35.09 60.33,35.09 | 60.33,35.09 60.33,34.73 60.77,34.73 61.45,34.04 61.45,33.76 R28.1 | R27.2 60.33,35.09 | R29.1 R28.1
N$31  (via drill 0.33 pad 0.69)
  Top 0.152: v21.88,15.88 21.66,15.78 19.74,15.78 19.2,16.32 16.26,16.32 13.61,13.98 13.55,11.7 15.88,11.68 R51.2 R59.2 | C33.- 50.51,18.09 49.66,18.93 v43.51,18.93
  Bottom 0.152: v21.88,15.88 21.88,15.9 24.45,18.73 43.33,18.74 v43.51,18.93
N$32
  Top 0.152: R49.2 C40.1 | R49.2 19.25,13.65 IC10.2 | R51.1 R49.2
N$33  (via drill 0.33 pad 0.69)
  Top 0.152: IC10.1 19.25,14.92 19.25,15.77 19.05,15.97 16.61,15.97 C40.2 R49.1 15.98,13.02 v14.61,12.7 | R61.2 15.56,8.26 v14.57,8.73
  Bottom 0.152: v14.57,8.73 v14.61,12.7
N$34
  Top 0.152: LED3.1 120.33,3.53 119.71,3.53 117.79,5.45 R6.1
N$35  (via drill 0.33 pad 0.69)
  Top 0.152: R28.2 62.23,36.19 61.65,36.77 v61.65,36.81
  Bottom 0.152: v61.65,36.81 60.79,35.95 60.79,7.21 61.93,6.07 62.55,6.07 POS_POT.2
N$36  (via drill 0.33 pad 0.69)
  Top 0.152: v133.99,9.53 R15.1
  Bottom 0.152: RP_TRIG.2 135.57,9.53 v133.99,9.53
N$37
  Top 0.152: Q2.B 136.4,11.11 R15.2
N$38
  Top 0.152: REC_LED-BTN.1 R2.2
N$39
  Top 0.152: R5.1 122.09,7.72 122.09,7.63 122.08,7.62 LED3.3
N$40
  Top 0.152: LED4.1 128.59,3.53 127.97,3.53 125.89,5.61 R3.1
N$41
  Top 0.152: LED4.3 130.34,7.62 130.44,7.72 R4.1
N$42  (via drill 0.33 pad 0.69)
  Top 0.152: IC9.7 11.55,13.65 11.55,13.79 11.95,14.18 13.12,14.18 14.84,15.9 v14.84,15.99 | R53.2 51.33,36.91 v52.42,35.82
  Bottom 0.152: v14.84,15.99 19.03,20.18 44.57,20.18 54.14,10.61 54.14,9.75 52.39,8 | 52.39,8 | 52.39,8 GAIN.2 54.2,9.43 54.2,34.05 v52.42,35.82
N$43
  Top 0.152: IC1.15 113.51,15.68 113.02,15.68 112.8,15.91 112.8,18.04 112.66,18.17 111.81,18.17 111.68,18.04 111.68,14.35 108.58,13.34 106.21,10.47 101.92,10.47 R10.2
N$44  (via drill 0.33 pad 0.69)
  Top 0.152: R9.2 107.63,10.47 108.97,11.42 v109.5,11.85 | v111.93,21 112.22,20.55 114.62,20.54 114.78,21.33 IC1.1
  Bottom 0.152: v111.93,21 111.93,21.1 111.29,21.74 110.75,21.74 110.42,21.41 110.42,12.84 v109.5,11.85
N$45  (via drill 0.33 pad 0.69)
  Top 0.152: IC1.2 113.51,21.83 113.59,21.83 v114.03,21.39 | R8.2 110.79,9.74 111.26,9.91 v112.99,9.91
  Bottom 0.152: v112.99,9.91 113.19,9.91 114.07,11.75 114.07,21.35 v114.03,21.39
N$46  (via drill 0.33 pad 0.69)
  Top 0.152: IC1.3 112.24,21.83 112.26,21.83 v112.92,21.17 | R7.2 115.41,10.47 115.02,10.47 v113.5,11.98
  Bottom 0.152: v113.5,11.98 113.5,20.59 v112.92,21.17
N$47  (via drill 0.33 pad 0.69)
  Top 0.152: R6.2 117.79,9.01 114.71,9.01 112.44,11.6 v110.86,12.19 | v110.99,21.17 110.97,21.19 IC1.4
  Bottom 0.152: v110.86,12.19 110.86,12.82 110.86,20.98 111.18,20.98 v110.99,21.17
N$48  (via drill 0.33 pad 0.69)
  Top 0.152: R5.2 122.87,10.15 122.73,10.29 v122.73,10.92 | v109.39,21.24 109.7,21.55 IC1.5
  Bottom 0.152: v122.73,10.92 115,18.66 115,21.28 114.23,22.05 110.19,22.05 v109.39,21.24
N$49  (via drill 0.33 pad 0.69)
  Top 0.152: IC1.6 108.43,24.32 115.45,24.32 v116.9,22.88 | R3.2 125.89,10.15 125.4,10.15 v123.68,11.87
  Bottom 0.152: v116.9,22.88 116.9,18.66 v123.68,11.87
N$50  (via drill 0.33 pad 0.69)
  Top 0.152: R4.2 131.6,8.69 125.2,8.69 124.38,9.51 v124.38,9.78 | v107.28,21.24 107.16,21.37 IC1.7
  Bottom 0.152: v124.38,9.78 124.38,10.15 115.5,19.02 115.5,21.28 114.43,22.35 108.39,22.35 v107.28,21.24
N$51  (via drill 0.33 pad 0.69)
  Top 0.152: v55.72,44.12 52.71,44.12 52.06,44.13 R55.2 | IC9.1 6.35,14.92 6.38,14.89 v7.12,14.89
  Bottom 0.152: v55.72,44.12 55.72,8.74 52.92,5.93 52.39,5.93 | 52.39,5.93 51.88,5.93 44.09,13.72 44.09,19.16 43.75,19.5 43.28,19.5 42.93,19.15 | 42.93,19.15 | 42.93,19.15 24.02,19.15 19.76,14.89 | 19.76,14.89 | 19.76,14.89 v7.12,14.89 | GAIN.3 52.39,5.93
N$52  (via drill 0.33 pad 0.69)
  Top 0.152: R47.1 12.7,15.87 13.46,16.62 20.41,16.62 v20.18,16.54
  Bottom 0.152: GAIN.1 52.39,11.32 43.88,19.84 23.48,19.84 v20.18,16.54
N$53  (via drill 0.33 pad 0.69)
  Top 0.152: R46.1 2.54,14.41 2.7,14.25 6.4,14.25 v6.87,13.46
  Bottom 0.152: GAIN.4 41.16,13.46 v6.87,13.46
N$54
  Top 0.152: R47.2 11.92,13.44 11.92,12.76 11.55,12.38 | R58.1 11.92,11.96 11.92,12.01 11.55,12.38 | IC9.6 11.55,12.38
N$55
  Top 0.152: 20.46,38.56 18.74,38.56 16.19,36.02 R11.2 | 20.46,38.56 20.46,39.03 17.09,42.39 14.25,42.39 IC2.2 | C2.+ 20.46,38.56
N$56
  Top 0.152: D1.A 12.73,35.56 12.64,35.47 POWER.1
N$57  (via drill 0.33 pad 0.69)
  Top 0.152: R12.1 133.04,14.61 133.02,14.59 v132.65,14.59
  Bottom 0.152: RP_TRIG.1 133.03,14.21 v132.65,14.59
N$58
  Top 0.152: IC9.2 3.69,13.65 3.48,13.44 R46.2 R57.1
N$59
  Top 0.152: IC8.26 39.61,32.87 38.74,32.87 35.48,34.86 Q4.1 31.53,34.86 31.53,34.87 C47.2
N$60
  Top 0.152: IC8.25 40.26,39.73 35.48,44.51 Q4.2 31.53,44.51 C48.2
N$64
  Top 0.152: D2.C 11.78,23.5 11.69,23.58 POWER.4
N$66
  Top 0.152: Q1.B 136.4,14.6 136.4,14.61 R12.2
PA4  (via drill 0.33 pad 0.69)  (1 unrouted)
  Top 0.152: IC5.20 81.91,20 | 81.91,20 | 81.91,20 81.86,20 80.88,19.01 v79.47,19.01 | 70.66,41.59 71.5,40.75 v71.5,40.21 | 70.66,41.59 71.16,41.59 72.15,42.58 72.58,42.58 73.7,43.7 73.7,43.99 74.94,45.23 85.24,45.23 SPI.3 | ORIG_MAP.5 70.66,41.59
  Bottom 0.152: v79.47,19.01 79.47,19.26 71.5,27.23 v71.5,40.21
PA5  (via drill 0.33 pad 0.69)  (1 unrouted)
  Top 0.152: v81.69,19.01 81.69,19.07 IC5.21 | SPI.4 85.68,43.13 75.24,43.13 73.7,41.59 ORIG_MAP.7
  Bottom 0.152: v81.69,19.01 81.69,19.59 72.71,28.57 72.71,40.6 ORIG_MAP.7
PA6  (via drill 0.33 pad 0.69)  (1 unrouted)
  Top 0.152: 76.24,41.59 75.7,41.59 75.43,41.32 75.43,41.26 77.5,39.18 v78.3,39.18 | SPI.5 87.67,42.58 77.23,42.58 76.24,41.59 | v83.83,21.28 83.83,20.68 83.2,20.05 IC5.22 | ORIG_MAP.9 76.24,41.59
  Bottom 0.152: v78.3,39.18 78.3,26.8 v83.83,21.28
PA7  (via drill 0.33 pad 0.69)  (1 unrouted)
  Top 0.152: v84.31,20.33 84.14,20.17 84.14,20.11 IC5.23 | SPI.6 89.62,41.99 79.18,41.99 78.78,41.59 ORIG_MAP.11
  Bottom 0.152: ORIG_MAP.11 77.79,40.6 77.73,40.54 77.73,26.57 83.96,20.33 v84.31,20.33
PC2  (via drill 0.33 pad 0.69)  (1 unrouted)
  Top 0.152: v84.37,25.62 84.37,26.01 IC5.10
  Bottom 0.152: NEW_MAP.3 72.25,49.39 78.34,49.39 80.73,47 80.73,31.61 84.37,27.98 v84.37,25.62
PC3  (via drill 0.33 pad 0.69)  (1 unrouted)
  Top 0.152: v82.39,27.7 82.39,27.29 IC5.11
  Bottom 0.152: NEW_MAP.4 74.48,49.08 78.22,49.08 79.77,47.53 79.77,30.32 v82.39,27.7
PC4  (via drill 0.33 pad 0.69)  (1 unrouted)
  Top 0.152: v83.07,18.45 83.19,18.45 IC5.24
  Bottom 0.152: v83.07,18.45 83.07,18.63 76.41,25.29 76.41,46.14 NEW_MAP.5 73.43,45.49 67.54,45.49 66.08,44.03 66.08,43.57 65.09,42.58 ORIG_MAP.1
PC5  (via drill 0.33 pad 0.69)  (1 unrouted)
  Top 0.152: IC5.25 84.92,19.48 v84.92,19.76 | ORIG_MAP.3 68.62,41.59 69.61,42.58 70.04,42.58 71.44,43.98 71.44,44.27 72.71,45.54 76.02,45.54 NEW_MAP.6
  Bottom 0.152: NEW_MAP.6 76.8,46.32 76.8,27 84.05,19.75 84.91,19.75 v84.92,19.76
PC6  (via drill 0.33 pad 0.69)  (1 unrouted)
  Top 0.152: IC5.37 90.41,18.56 v89.63,19.19
  Bottom 0.152: NEW_MAP.1 67.81,50.03 98.54,50.03 100.65,47.92 100.65,36.15 94.71,30.02 94.71,25.58 90.42,21.28 90.1,20.01 89.6,19.19 v89.63,19.19
PC7  (via drill 0.33 pad 0.69)  (1 unrouted)
  Top 0.152: IC5.38 90.96,18.72 90.96,18.85 v89.19,20.62
  Bottom 0.152: NEW_MAP.2 70.04,49.72 81.41,49.72 83.19,47.94 83.19,36.97 88.17,31.98 88.17,21.63 v89.19,20.62
PITCH_POT  (via drill 0.33 pad 0.69)  (1 unrouted)
  Top 0.152: v85.06,26.36 84.73,26.36 IC5.9 | STPB_POTS.4 85.32,10.16 v87.87,12.71
  Bottom 0.152: v87.87,12.71 87.87,24.89 86.31,26.45 85.16,26.45 v85.06,26.36
PLAY  (via drill 0.33 pad 0.69)  (1 unrouted)
  Top 0.152: v138.57,11.35 139.03,10.89 139.53,10.89 Q2.C R16.1 | IC5.58 92.52,28.49 109.89,28.49 v110.26,28.12
  Bottom 0.152: v138.57,11.35 138.57,11.49 121.94,28.12 v110.26,28.12
POSITION_POT_CV  (1 unrouted)
  Top 0.152: IC5.16 80.83,25.31 | 80.83,25.31 77.44,25.31 74.47,28.28 68.44,28.82 66.75,30.16 60.96,30.16 IC3.7 60.96,32.16 60.96,32.82 60.53,32.82 60.33,33.03 R27.1 C9.2 | 80.83,25.31
REC  (1 unrouted)
  Top 0.152: R14.1 Q1.C 139.53,14.38 134.01,20.22 106.13,20.22 103.01,23.02 95.65,23.02 90.99,27.67 IC5.59
RESET  (via drill 0.33 pad 0.69)  (1 unrouted)
  Top 0.152: IC5.7 85.18,27.32 85.31,27.45 87.12,27.45 87.74,28.06 v88.79,28.06 | v93.78,29.33 139.75,29.33 142.34,30.01 | v144.33,39.12 143.93,38.72 142.34,38.72 SW5.B 142.34,41.46 142.34,42.38 141.19,43.53 R17.1 | SW5.B' 142.34,32 142.34,31.92 142.34,30.01 | 142.34,30.01 147.17,30.01 JP2.10
  Bottom 0.152: v88.79,28.06 92.5,28.06 v93.78,29.33 | JP2.10 149.73,32.89 148.87,32.89 144.33,37.43 v144.33,39.12
RIN
  Top 0.152: C36.+ 44.12,40.63 42.23,38.73 42.23,34.29 42.86,34.29 44.13,33.02 44.13,30.45 IC8.19
ROUT
  Top 0.152: IC8.13 46.11,24.1 49.97,27.95 C41.+
ROUT_JACK
  Top 0.152: OUT-R.1 24.77,6.39 26.04,7.67 26.04,7.94 R62.1
RX  (via drill 0.33 pad 0.69)  (1 unrouted)
  Top 0.152: IC5.43 92.72,20.49 92.72,21.15 v93.28,21.71
  Bottom 0.152: v93.28,21.71 93.52,21.71 97.46,25.66 97.46,25.95 105.48,33.97 125.54,33.97 136.97,22.54 JP1.4
SIZE_CV  (1 unrouted)
  Top 0.152: 66.04,31.34 68.33,29.37 73.94,29.25 77.32,25.86 80.99,25.86 IC5.15 | 66.04,31.34 65.83,31.56 C10.2 R25.1 | IC4.14 66.04,31.34
SIZE_POT  (via drill 0.33 pad 0.69)  (1 unrouted)
  Top 0.152: v86.04,25.88 86.04,26.19 85.3,26.93 84.87,26.93 IC5.8 | STPB_POTS.2 86.38,5.08 v90.57,9.27
  Bottom 0.152: v86.04,25.88 86.2,25.88 87.31,24.77 87.12,12.52 90.49,9.27 v90.57,9.27
SW_LOAD  (via drill 0.33 pad 0.69)  (1 unrouted)
  Top 0.152: v110.11,25.93 109.81,26.23 95.21,26.23 94.99,26.02 IC5.51
  Bottom 0.152: ML_BTN.2 140.3,2.54 140.3,1.92 139.12,0.74 138.34,0.74 137.16,1.93 137.16,10.89 122.64,25.41 110.63,25.41 | 110.63,25.41 | 110.63,25.41 v110.11,25.93
SW_MODE  (via drill 0.33 pad 0.69)  (1 unrouted)
  Top 0.152: IC5.52 94.82,26.55 122.7,26.55 v123.89,25.36
  Bottom 0.152: ML_BTN.1 137.76,2.54 137.76,11.49 v123.89,25.36
SW_REC  (via drill 0.33 pad 0.69)  (1 unrouted)
  Top 0.152: IC5.61 94.39,32.49 v116.9,32.49
  Bottom 0.152: REC_LED-BTN.2 150.18,9.17 149.19,9.17 147.35,7.34 143.27,7.34 142.85,7.76 142.85,7.88 118.24,32.49 v116.9,32.49
TEXTURE_CV  (1 unrouted)
  Top 0.152: IC5.14 81.25,26.3 78.08,26.3 73.66,30.72 IC4.8 73.66,32.59 73.66,33.21 73.69,33.24 73.88,33.24 C11.2 R26.1
TEXTURE_POT
  Bottom 0.152: STPB_POTS.3 70.67,9.39 70.67,16.34 69.42,17.59 69.42,38.94 71.31,40.83 71.31,44.2 72.23,45.12 73.27,45.12 74.26,44.13 ORIG_MAP.10
TX  (via drill 0.33 pad 0.69)  (1 unrouted)
  Top 0.152: v100.92,19.65 98.73,17.47 95.04,17.47 IC5.42
  Bottom 0.152: JP1.5 137.59,20 123.93,33.66 114.93,33.66 v100.92,19.65
V_OCT  (via drill 0.33 pad 0.69)
  Top 0.152: v67.08,27.78 66.36,27.06 66.04,27.06 IC4.1 66.04,25.2 66.04,24.57 66.01,24.54 65.83,24.54 C20.2 R34.1
  Bottom 0.152: ORIG_MAP.6 70.17,43.14 68.9,41.87 68.9,29.6 v67.08,27.78
VCC
  Top 0.152: 18.7,28.42 22.19,24.93 22.19,19.98 19.45,17.24 8.47,17.24 C38.1 8.47,15.78 8.89,15.36 8.89,14.92 IC9.8 | C39.1 30.85,16.51 31.27,16.09 31.27,13.12 31.09,12.94 29.83,12.94 29.65,12.76 29.65,11.38 34.5,6.53 36.96,6.53 37.53,5.96 37.53,5.11 IC7.3 | 18.7,28.42 20.46,30.19 C1.+ 20.46,32.04 17.87,34.63 17.46,34.63 D1.C | R11.1 18.7,28.42 | 22.23,16.83 22.23,16.51 22.54,16.19 22.54,14.92 IC10.8
  Top 0.406: IC10.8 25.78,16.35 C39.1 | 22.19,19.98 22.19,16.86 22.23,16.83
VEE  (via drill 0.33 pad 0.69)
  Top 0.152: 7.69,12.53 7.69,15.13 7.64,15.19 7.64,17.06 13.14,22.57 14.65,22.57 15.58,23.5 D2.A C13.- 20.46,24.76 v20.95,25.25 | 6.27,11.11 7.69,12.53 | 21.69,9.53 15.99,9.53 14.53,10.99 12.27,10.99 11.62,11.65 8.58,11.65 7.69,12.53 | 21.69,9.53 21.69,9.94 21.91,10.15 21.91,11.11 IC10.4 | C46.2 21.69,9.53 | R30.1 54.75,40.64 v54.39,41.13 | 6.27,11.11 6.35,11.11 6.35,10.68 6.77,10.25 C45.2 | IC9.4 6.27,11.11
  Bottom 0.152: v20.95,25.25 35.97,25.25 v54.39,41.13

## Text on the board
tNames: +3v3,G,SS,SCK,MISO,MOSI | cc-by-sa Olivier Gillet, 2015. v3 - mod1 XNOR 2015 | Clouds | JTAG | SYSBOOT | RESET | GND | <TX | FTDI DONGLE | green | green | green | green | led,btn | rec, play | mode, load | GND | GND | GND | +3v3_a,Sz,Tx,P,B,Gnd | GND, SIG, +V | RED | RED | RED | GND closer to edge
bNames: cc-by-sa Olivier Gillet, 2015. v3 | Clouds | 12/15 XNOR / Moved POTS/Jacks off board [headers] / added SPI/SD port / added port to remap: LED_EN, LED_SCK, V_OCT, BLEND_CV, TEXT_POT, BLEND_POT so that SPI port can be exposed / use ORIG_MAP for original, NEW_MAP for SPI / needs software change